# EAGLE design 0127-sd-card-micro (EAGLE 9.6.2)
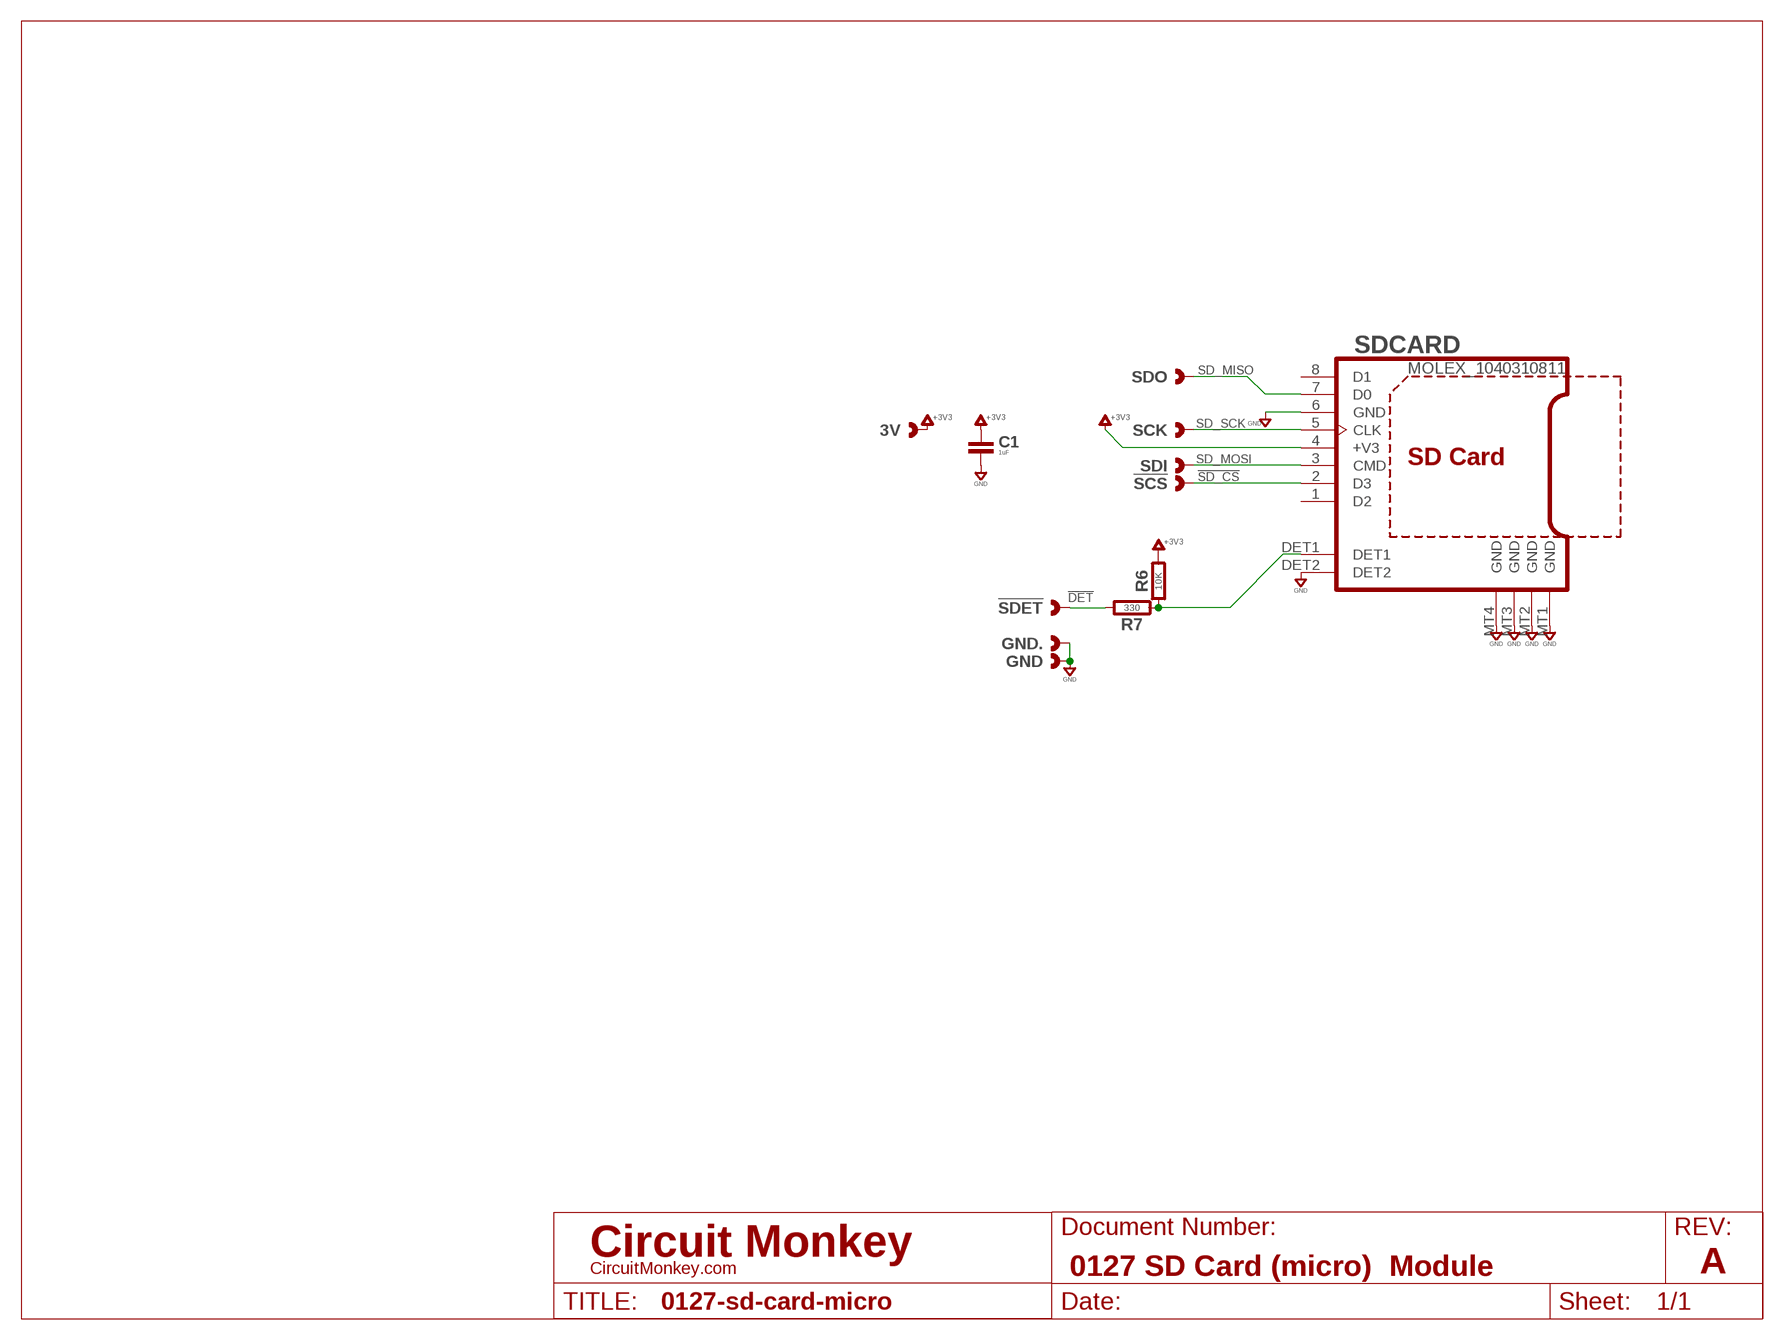
[diagram p0: schematic, sheet 1]
U$1 (LETTER_L-CIRCUITMONKEY): DOCUMENT_NUMBER: 0127 SD Card (micro) Module; REV: A

## Parts
3V  CAST-01X12.00MM  [CAST01-2.00MM]
!SCS  CAST-01X12.00MM  [CAST01-2.00MM]
!SDET  CAST-01X12.00MM  [CAST01-2.00MM]
C1  1uF  CAPACITOR0603  [0603-CAP]
GND  CAST-01X12.00MM  [CAST01-2.00MM]
GND.  CAST-01X12.00MM  [CAST01-2.00MM]
R6  10K  RESISTOR0603  [0603-RES]
R7  330  RESISTOR0603  [0603-RES]
SCK  CAST-01X12.00MM  [CAST01-2.00MM]
SDCARD  MOLEX_1040310811  MICRO-SD-CARDMOLEX-1040310811  [MOLEX_1040310811_USD]
SDI  CAST-01X12.00MM  [CAST01-2.00MM]
SDO  CAST-01X12.00MM  [CAST01-2.00MM]

## Nets
!DET: !SDET.1 !SDET.P$1 !SDET.P$2 R7.2
!SD_CS: !SCS.1 !SCS.P$1 !SCS.P$2 SDCARD.2(D3)
!SD_DET: R6.1 R7.1 SDCARD.DET1
+3V3: 3V.1 3V.P$1 3V.P$2 C1.1 R6.2 SDCARD.4(+V3)
GND: C1.2 GND.1 GND..1 GND..P$1 GND..P$2 GND.P$1 GND.P$2 SDCARD.6(GND) SDCARD.DET2 SDCARD.MT1(GND) SDCARD.MT2(GND) SDCARD.MT3(GND) SDCARD.MT4(GND)
SD_MISO: SDCARD.7(D0) SDO.1 SDO.P$1 SDO.P$2
SD_MOSI: SDCARD.3(CMD) SDI.1 SDI.P$1 SDI.P$2
SD_SCK: SCK.1 SCK.P$1 SCK.P$2 SDCARD.5(CLK)
Unconnected: SDCARD.1(D2) SDCARD.8(D1)

## Library data of the parts
3V !SCS !SDET GND GND. SCK SDI SDO = con-headers:CAST-01X1: Castelated Edge Hole Pad
C1 = rlc:CAPACITOR: Capacitor; COST01: 0.12; COST10: 0.09; COST100: 0.05
R6 R7 = rlc:RESISTOR: Resistor; COST01: 0.10; COST10: 0.05; COST100: 0.02
SDCARD = con-memory-card:MICRO-SD-CARD: MICRO-SD; COST01: 2.25; COST10: 1.90; COST100: 1.60; MFR: Molex; MPN: 1040310811

## Board
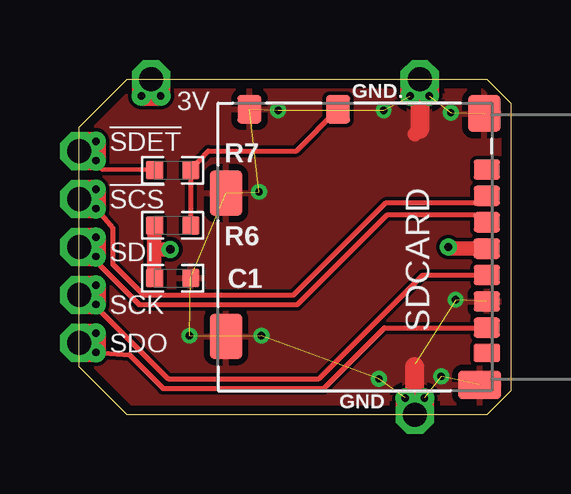
[diagram p1: board, top side]
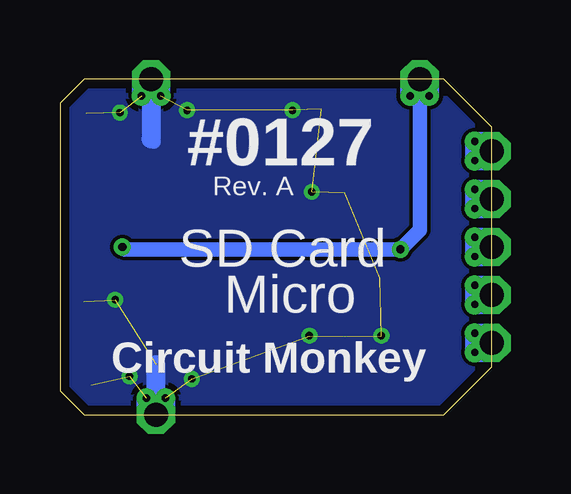
[diagram p2: board, bottom side, seen from below]

Size 18 x 14 mm. Coordinates in mm from the lower left corner, seen from the top.
Outline: 2,0 0,2 0,12 2,14 17,14 18,13 18,1 17,0 2,0
Copper layers (1*16): Top 0.0356mm / dielectric 1.5011mm / Bottom 0.0356mm
Design rules "OSH-CircuitMonkey *": minimum track width 6mil, minimum drill 12mil, track to track 6mil, track to pad 6mil, pad to pad 6mil, via to via 6mil, smd to smd 6mil, copper to edge 15mil, drill to drill 6mil, minimum pad ring 7mil, minimum via ring 7mil, stop-mask expansion 3mil, vias tented up to drill 13mil, thermal gap 10mil

### Footprints (pad centres in the part's own frame; a part is rotated, then mirrored left to right if it is on the bottom)
CAST01-2.00MM = drill 1 pad 1.6 octagon: 1 0,0 | drill 0.305 pad 0.813: P$1 -0.7,0.4; P$2 -0.7,-0.4
0603-CAP = smd 0.711 x 0.762: 1 -0.752,0; 2 0.752,0
0603-RES = smd 0.711 x 0.762: 1 -0.752,0; 2 0.752,0
MOLEX_1040310811_USD = smd 0.85 x 1.1: 1 3.23,-5.503; 2 2.13,-5.503; 3 1.03,-5.503; 4 -0.07,-5.503; 5 -1.17,-5.503; 6 -2.27,-5.503; 7 -3.37,-5.503 | smd 0.75 x 1.1: 8 -4.42,-5.503 | smd 1.2 x 1: DET1 5.74,0.7; DET2 5.74,4.4 | smd 1.55 x 1.35: MT1 5.565,-5.4 | smd 1.17 x 1.8: MT2 -5.755,-5.2 | smd 1.9 x 1.35: MT3 -3.73,5.375; MT4 2.24,5.375

### Placement (x,y rotation side)
3V  3,14 90 top
!SCS  0,9 180 top
!SDET  0,11 180 top
C1  3.9,5.7 0 top
GND  14,0 270 top
GND.  14.2,14 90 top
R6  3.9,7.9 180 top
R7  3.9,10.2 180 top
SCK  0,5 180 top
SDCARD  11.5,7 90 top
SDI  0,7 180 top
SDO  0,3 180 top

### Tracks (layer width: path | path; a pad name or v marks a point on that pad's centre or on a via)
!DET
  Top 0.2: R7.2 0.97,10.23 !SDET.P$1 0.69,10.51 0.6,10.51 0.11,11 !SDET.1 0.2,11 !SDET.P$2
!SD_CS
  Top 0.2: !SCS.P$2 0.5,9.5 !SCS.1 0.5,8.5 !SCS.P$1 1.4,7.8 1.4,6.29 2.71,4.98 8.93,4.98 12.78,8.83 16.5,8.83 16.8,9.13 SDCARD.2
!SD_DET
  Top 0.2: SDCARD.DET1 9.06,11 5.4,11 R7.1 R6.1
+3V3  (via drill 0.35)
  Top 0.152: 3V.P$2 3.5,13.5 3V.1 2.5,13.5 3V.P$1
  Top 0.6: R6.2 3.12,6.9 | 3.12,6.9 3.12,5.72 C1.1 | v3.8,6.9 3.12,6.9 | v15.4,7 15.43,7 15.5,6.93 SDCARD.4
  Bottom 0.6: 3V.1 3,7.7 v3.8,6.9 15.3,6.9 v15.4,7
GND  (via drill 0.3)  (17 unrouted)
  Top 0.152: GND.P$1 14.5,0.5 GND.1 13.5,0.5 GND.P$2 | GND..P$2 14.7,13.5 GND..1 13.7,13.5 GND..P$1
  Top 0.6: 14.2,11.9 14,11.7
  Top 0.8: GND.1 14,2 | GND..1 14.2,11.9
  Bottom 0.6: 14.2,11.5 14.1,11.4
  Bottom 0.8: GND..1 14.2,11.5 | GND.1 14,2.1
  other vias: 4.6,3.3 7.6,3.3 7.5,9.3 15.5,12.6 15.1,1.6 12.5,1.5 15.7,4.8 8.3,12.7 12.7,12.7
  pour Bottom: 0,0 18,0 18,14 0,14
  pour Top (rank 4): 0,0 19,0 19,14 0,14
SD_MISO
  Top 0.2: SDO.P$2 0.5,3.5 SDO.1 0.5,2.5 SDO.P$1 2.1,2.5 3.5,1.1 10.2,1.1 12.73,3.63 SDCARD.7
SD_MOSI
  Top 0.2: SDI.1 0.5,7.5 SDI.P$2 | SDI.1 0.5,6.5 SDI.P$1 | SDI.1 0.1,7 2.5,4.6 9.1,4.6 12.83,8.33 16.5,8.33 16.8,8.03 SDCARD.3
SD_SCK
  Top 0.2: SCK.1 0.5,5.5 SCK.P$2 | SCK.1 0.6,4.4 SCK.P$1 | SCK.1 0.2,5 3.7,1.5 10,1.5 14.33,5.83 SDCARD.5

### Text on the board
bPlace: #0127 | Rev. A | SD Card / Micro | Circuit Monkey